# Altium schematic sheet RegisterInstruction.SchDoc: Instruction Register
size A4; Author: Ben Eater; DrawnBy: LittleYe233; SheetNumber: 4; SheetTotal: 7
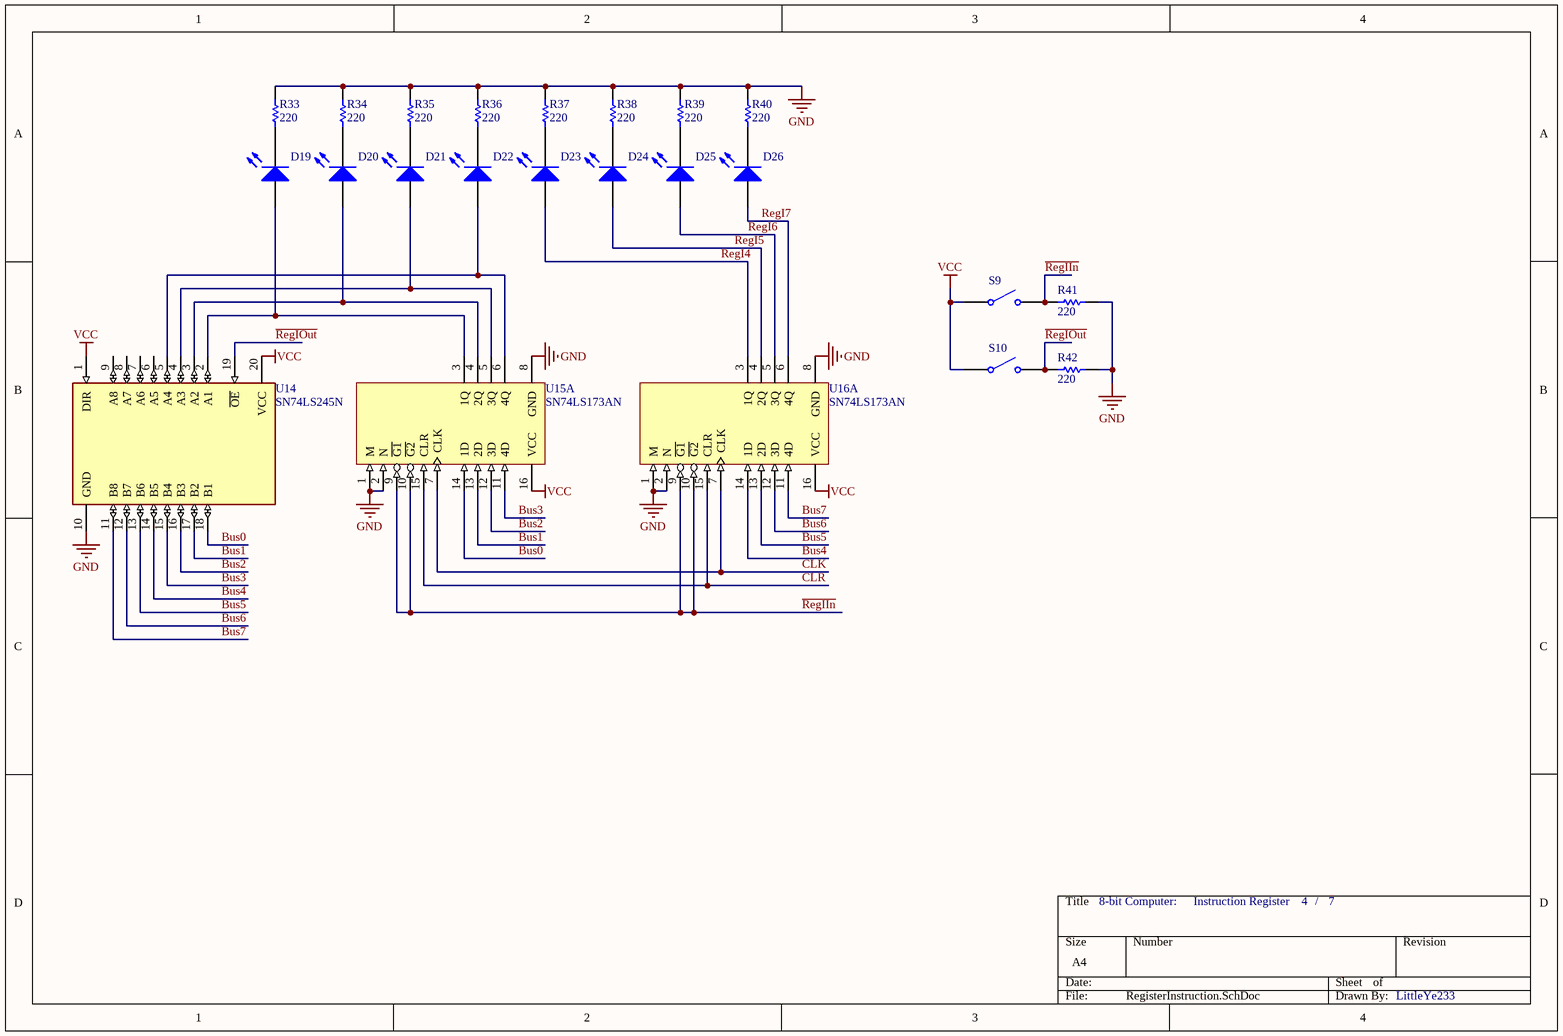
[diagram p0: RegisterInstruction.SchDoc]

## Parts
D19  Light-Emitting Diode  (value not drawn)
D20  Light-Emitting Diode  (value not drawn)
D21  Light-Emitting Diode  (value not drawn)
D22  Light-Emitting Diode  (value not drawn)
D23  Light-Emitting Diode  (value not drawn)
D24  Light-Emitting Diode  (value not drawn)
D25  Light-Emitting Diode  (value not drawn)
D26  Light-Emitting Diode  (value not drawn)
R33  value 220  (hidden comment: Resistor)
R34  value 220  (hidden comment: Resistor)
R35  value 220  (hidden comment: Resistor)
R36  value 220  (hidden comment: Resistor)
R37  value 220  (hidden comment: Resistor)
R38  value 220  (hidden comment: Resistor)
R39  value 220  (hidden comment: Resistor)
R40  value 220  (hidden comment: Resistor)
R41  value 220  (hidden comment: Resistor)
R42  value 220  (hidden comment: Resistor)
S9  Single-Pole, Single-Throw Switch  (value not drawn)
S10  Single-Pole, Single-Throw Switch  (value not drawn)
U14  SN74LS245N  [FP-N0020A-MFG]
U15  SN74LS173AN  [N0016A]  (part A of 2)
U16  SN74LS173AN  [N0016A]  (part A of 2)

## Nets
GND: R33.2 R34.2 R35.2 R36.2 R37.2 R38.2 R39.2 R40.2 R41.1 R42.1 U14.10(GND) U15.1(M) U15.2(N) U15.8(GND) U16.1(M) U16.2(N) U16.8(GND)
VCC: S9.1 S10.1 U14.1(DIR) U14.20(VCC) U15.16(VCC) U16.16(VCC)
Bus0: U14.18(B1) U15.14(1D)
Bus1: U14.17(B2) U15.13(2D)
Bus2: U14.16(B3) U15.12(3D)
Bus3: U14.15(B4) U15.11(4D)
Bus4: U14.14(B5) U16.14(1D)
Bus5: U14.13(B6) U16.13(2D)
Bus6: U14.12(B7) U16.12(3D)
Bus7: U14.11(B8) U16.11(4D)
CLK: U15.7(CLK) U16.7(CLK)
CLR: U15.15(CLR) U16.15(CLR)
~{RegIIn}: R41.2 S9.2 U15.9(~{G1}) U15.10(~{G2}) U16.9(~{G1}) U16.10(~{G2})
~{RegIOut}: R42.2 S10.2 U14.19(~{OE})
RegI4: D23.1(A) U16.3(1Q)
RegI5: D24.1(A) U16.4(2Q)
RegI6: D25.1(A) U16.5(3Q)
RegI7: D26.1(A) U16.6(4Q)
NetD19_1: D19.1(A) U14.2(A1) U15.3(1Q)
NetD19_2: D19.2(K) R33.1
NetD20_1: D20.1(A) U14.3(A2) U15.4(2Q)
NetD20_2: D20.2(K) R34.1
NetD21_1: D21.1(A) U14.4(A3) U15.5(3Q)
NetD21_2: D21.2(K) R35.1
NetD22_1: D22.1(A) U14.5(A4) U15.6(4Q)
NetD22_2: D22.2(K) R36.1
NetD23_2: D23.2(K) R37.1
NetD24_2: D24.2(K) R38.1
NetD25_2: D25.2(K) R39.1
NetD26_2: D26.2(K) R40.1

Not connected (* = marked no-connect by the designer): U14 6(A5) 7(A6) 8(A7) 9(A8)

## Notes on the sheet
- 8-bit Computer:
- /

## Library data of the parts
D19-D26 = LED: AF: 1; BV: 0; BV_MAX: 1e99; EG: 1.11; FC: 0.5; IBV: 0.001; IS: 1e-14; MJSW: 0.33; NTUN: 30; TNOM: 27; XTI: 3; SimulationGenericComponent: True; CJO: 0; CJP: 0; CTA: 0; CTP: 0; FCS: 0.5; FV_MAX: 1e99; IKF: 0; IKR: 0; ISR: 1e-14; JSW: 0; JTUN: 0; JTUNSW: 0; KEG: 1; KF: 0; LEVEL: 1; N: 1; NBV: 1; NR: 1; NS: 1; PHP: 1; RS: 0; TCV: 0; TLEV: 0; TLEVC: 0; TM1: 0; TM2: 0; TPB: 0; TPHP: 0; TRS: 0; TRS2: 0; TT: 0; TTT1: 0; TTT2: 0; VJ: 1; XTITUN: 3
R33-R42 = Resistor: TC1: 0; SimulationGenericComponent: True; TC2: 0
S9 S10 = SPST SW: closed: 0; Rclosed: 1m; Ropen: 1Meg; SimulationGenericComponent: True
U14 = CMP-1620-00419-3: IC TXRX NON-INVERT 5.25V 20DIP; Number of Bits per Element: 8; Polarity: Non-Inverting; Low Level Output Current: 24mA; Propagation Delay: 12ns; Min Supply Voltage: 4.75V; Number of Elements: 1; Quiescent Current: 62mA; Logic Function: Transceiver; Direction: Bidirectional; Operating Supply Voltage: 5V; High Level Output Current: -15mA; Mount: Through Hole; Min Operating Temperature: 0°C; Number of Outputs: 8; Max Operating Temperature: 70°C; Max Supply Voltage: 5.25V; Width: 6.35mm; Number of Pins: 20; RoHS Compliant: Yes; Turn-On Delay Time: 12ns; Termination: Through Hole; Number of Channels: 8; Number of Circuits: 8; Weight: 0.042297oz; Package Quantity: 20; Number of Transceivers: 8; Length: 24.33mm; Height: 4.57mm; REACH SVHC: No SVHC; Contact Plating: Gold; Number of Bits: 8; Lead Free: Lead Free; Case/Package: PDIP; Packaging: Rail/Tube; Radiation Hardening: No
U15 U16 = CMP-1619-00777-2: 4-Bit D-type Registers with 3-State Outputs, N0016A, TUBE; Manufacturer: Texas Instruments; VCC(Max)(V): 5.25; ICC @ Nom Voltage(Max)(mA): 24; F @ Nom Voltage(Max)(Mhz): 35; Bits(#): 4; tpd @ Nom Voltage(Max)(ns): 30; Output Logic: Non-inverted; VCC(Min)(V): 4.75; 3-State Output: Yes; Voltage(Nom)(V): 5; Output Drive (IOL/IOH)(Max)(mA): 24/-2.6; Rating: Catalog; Output: 3S; Input Type: TTL; Technology Family: LS; Schmitt Trigger: No; Operating Temperature Range(C): 0 to 70; DatasheetVersion: SDLS067A; Generic Part Number: SN74LS173A; Output Type: TTL; PackageReference: N0016A; Code_JEDEC: MS-001